# Altium schematic sheet Radio.SchDoc
size A
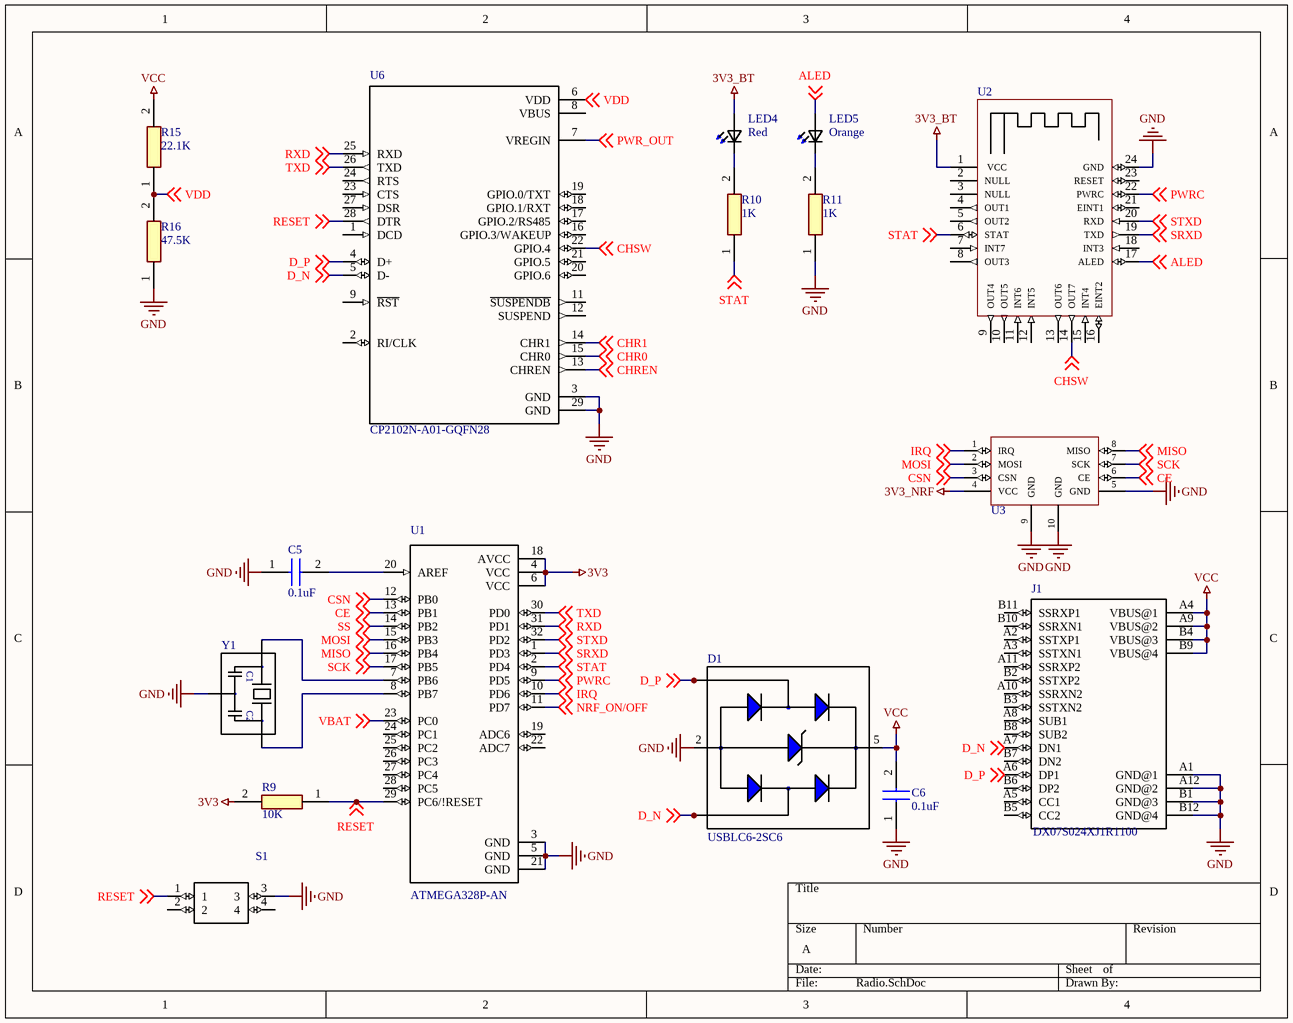
[diagram p0: Radio.SchDoc]

## Parts
C5  value 0.1uF  [*CAPC1608X95N]  (hidden comment: capacitor 0603)
C6  value 0.1uF  [*CAPC1608X95N]  (hidden comment: capacitor 0603)
D1  USBLC6-2SC6  [*SOT95P280X145-6N]
J1  DX07S024XJ1R1100  [*JAE_DX07S024XJ1R1100_DX07S024XJ1R1100(Primary)]
LED4  value Red  [*0603]  (hidden comment: HSMR-C191)
LED5  value Orange  [*0603]  (hidden comment: HSMR-C191)
R9  value 10K  [RESC1608X55N]  (hidden comment: resistor)
R10  value 1K  [RESC1608X55N]  (hidden comment: resistor)
R11  value 1K  [RESC1608X55N]  (hidden comment: resistor)
R15  value 22.1K  [RESC1608X55N]  (hidden comment: resistor)
R16  value 47.5K  [RESC1608X55N]  (hidden comment: resistor)
S1  PTS810SJK250SMTRLFS  [*PTS810SJG250SMTRLFS]  (value not drawn)
U1  ATMEGA328P-AN  [*QFP80P900X900X120-32N]
U2  JDY-23  [*JDY-23]  (value not drawn)
U3  NRF24L01P+  [NRF24L01P+]  (value not drawn)
U6  CP2102N-A01-GQFN28  [*QFN50P500X500X80-29N]
Y1  PBRC8.00MR10X000  [*XTAL_PBRC8.00MR10X000]  (value not drawn)

## Nets
3V3: R9.2 U1.4(VCC) U1.6(VCC) U1.18(AVCC)
3V3_BT: LED4.2(A2) U2.1(VCC)
3V3_NRF: U3.4(VCC)
GND: C5.1 C6.1 D1.2(GND) J1.A1(GND@1) J1.A12(GND@2) J1.B1(GND@3) J1.B12(GND@4) R11.1 R16.1 S1.3 U1.3(GND) U1.5(GND) U1.21(GND) U2.24(GND) U3.5(GND) U3.9(GND) U3.10(GND) U6.3(GND) U6.29(GND) Y1.2(GND)
VCC: C6.2 D1.5(VBUS) J1.A4(VBUS@1) J1.A9(VBUS@2) J1.B4(VBUS@3) J1.B9(VBUS@4) R15.2
ALED: LED5.2(A2) U2.17(ALED) ; off-sheet ALED
CE: U1.13(PB1) U3.6(CE) ; off-sheet CE
CHR0: U6.15(CHR0) ; off-sheet CHR0
CHR1: U6.14(CHR1) ; off-sheet CHR1
CHREN: U6.13(CHREN) ; off-sheet CHREN
CHSW: U2.14(OUT7) U6.22(GPIO.4) ; off-sheet CHSW
CSN: U1.12(PB0) U3.3(CSN) ; off-sheet CSN
D_N: D1.3(I/O2) D1.4(I/O2) J1.A7(DN1) U6.5(D-) ; off-sheet D_N
D_P: D1.1(I/O1) D1.6(I/O1) J1.A6(DP1) U6.4(D+) ; off-sheet D_P
IRQ: U1.10(PD6) U3.1(IRQ) ; off-sheet IRQ
MISO: U1.16(PB4) U3.8(MISO) ; off-sheet MISO
MOSI: U1.15(PB3) U3.2(MOSI) ; off-sheet MOSI
NRF_ON/OFF: U1.11(PD7) ; off-sheet NRF_ON/OFF
PWR_OUT: U6.7(VREGIN) ; off-sheet PWR_OUT
PWRC: U1.9(PD5) U2.22(PWRC) ; off-sheet PWRC
RESET: R9.1 S1.1 U1.29(PC6/!RESET) U6.28(DTR) ; off-sheet RESET
RXD: U1.31(PD1) U6.25(RXD) ; off-sheet RXD
SCK: U1.17(PB5) U3.7(SCK) ; off-sheet SCK
SRXD: U1.1(PD3) U2.19(TXD) ; off-sheet SRXD
SS: U1.14(PB2) ; off-sheet SS
STAT: R10.1 U1.2(PD4) U2.6(STAT) ; off-sheet STAT
STXD: U1.32(PD2) U2.20(RXD) ; off-sheet STXD
TXD: U1.30(PD0) U6.26(TXD) ; off-sheet TXD
VBAT: U1.23(PC0) ; off-sheet VBAT
VDD: R15.1 R16.2 U6.6(VDD) ; off-sheet VDD
NetC5_2: C5.2 U1.20(AREF)
NetLED4_1: LED4.1(K2) R10.2
NetLED5_1: LED5.1(K2) R11.2
NetU1_7: U1.7(PB6) Y1.1(IN)
NetU1_8: U1.8(PB7) Y1.3(OUT)

Not connected (* = marked no-connect by the designer): J1 A2(SSTXP1) A3(SSTXN1) A5(CC1) A8(SUB1) A10(SSRXN2) A11(SSRXP2) B2(SSTXP2) B3(SSTXN2) B5(CC2) B6(DP2) B7(DN2) B8(SUB2) B10(SSRXN1) B11(SSRXP1); S1 2 4; U1 19(ADC6) 22(ADC7) 24(PC1) 25(PC2) 26(PC3) 27(PC4) 28(PC5); U2 2(NULL) 3(NULL) 4(OUT1) 5(OUT2) 7(INT7) 8(OUT3) 9(OUT4) 10(OUT5) 11(INT6) 12(INT5) 13(OUT6) 15(INT4) 16(EINT2) 18(INT3) 21(EINT1) 23(RESET); U6 1(DCD) 2(RI/CLK) 8(VBUS) 9(~{RST}) 11(~{SUSPENDB}) 12(SUSPEND) 16(GPIO.3/WAKEUP) 17(GPIO.2/RS485) 18(GPIO.1/RXT) 19(GPIO.0/TXT) 20(GPIO.6) 21(GPIO.5) 23(CTS) 24(RTS) 27(DSR)

## Notes on the sheet
- (in symbol PBRC8.00MR10X000) C1; C2

## Library data of the parts
C5 C6 = capacitor 0603: Capacitor
D1 = USBLC6-2SC6: USBLC6 Series 2 Line 6 V Uni / Bi-Directional ESD Protection - SOT-23-6; MF: STMicroelectronics; Package: SOT-23-6 STMicroelectronics; Price: None; SnapEDA_Link: https://www.snapeda.com/parts/USBLC6-2SC6/STMicroelectronics/view-part/?ref=snap; MP: USBLC6-2SC6; Availability: Unavailable; Value: *
J1 = DX07S024XJ1R1100: Cut Tape - Usb Type c Receptacle Mid Mnt Dual r; MF: JAE Electronics; SnapEDA_Link: https://www.snapeda.com/parts/DX07S024XJ1R1100/JAE%20Electronics/view-part/?ref=snap; Package: None; MP: DX07S024XJ1R1100; Availability: Unavailable; Price: None; Value: *
LED4 LED5 = HSMR-C191: LED Indication - Discrete 3.4V 0603 _1608 Metric_; MF: Broadcom Limited; SnapEDA_Link: https://www.snapeda.com/parts/HSMR-C191/Broadcom%20Limited/view-part/2190324/?ref=snap; Availability: Unavailable; MP: HSMR-C191; Price: None; Package: 0603 Broadcom
S1 = PTS810SJK250SMTRLFS: Tactile Switch SPST-NO Top Actuated Surface Mount; MF: C&K; MP: PTS810 SJK 250 SMTR LFS; Package: None; Availability: Unavailable; Price: None; SnapEDA_Link: https://www.snapeda.com/parts/PTS810%20SJK%20250%20SMTR%20LFS/C%26K/view-part/3076435/?ref=snap; Value: *
U1 = ATMEGA328P-AN: AVR AVRÂ® ATmega Microcontroller IC 8-Bit 20MHz 32KB _16K x 16_ FLASH 32-TQFP _7x7_; MF: Microchip; SnapEDA_Link: https://www.snapeda.com/parts/ATMEGA328P-AN/Microchip/view-part/1227245/?ref=snap; Availability: Unavailable; Price: None; Package: TQFP-32 Microchip; MP: ATMEGA328P-AN; Value: *
U2 = JDY-23: Bluetooth Bluetooth v4.0 Transceiver Module 2.4GHz Integrated, Chip Surface Mount; MF: Sierra Wireless; SnapEDA_Link: https://www.snapeda.com/parts/BC118/Sierra%20Wireless/view-part/48683/?ref=snap; Price: None; Availability: Unavailable; Package: None; MP: JDY-23; Value: *
U6 = CP2102N-A01-GQFN28: USB Bridge, USB to UART USB 2.0 UART Interface 28-QFN _5x5_; MF: Silicon Labs; Package: QFN-28 Silicon Labs; Price: None; Availability: Unavailable; MP: CP2102N-A01-GQFN28; SnapEDA_Link: https://www.snapeda.com/parts/CP2102N-A01-GQFN28/Silicon%20Labs/view-part/554799/?ref=snap; Value: *
Y1 = PBRC8.00MR10X000: 8MHz Ceramic Resonator Built in Capacitor 15pF Â±0.1% -40Â°C ~ 85Â°C Surface Mount; MF: Kyocera International; Package: SMD-3 AVX / Kyocera; MP: PBRC8.00MR10X000; SnapEDA_Link: https://www.snapeda.com/parts/PBRC8.00MR10X000/Kyocera%20International%20Inc.%20Electronic%20Components/view-part/481757/?ref=snap; Availability: Unavailable; Price: None; Value: *
U3 = NRF24L01P+: Parameter 1: *